# EAGLE design HM-Relais4-flach-v01-036 (EAGLE 9.5.1)
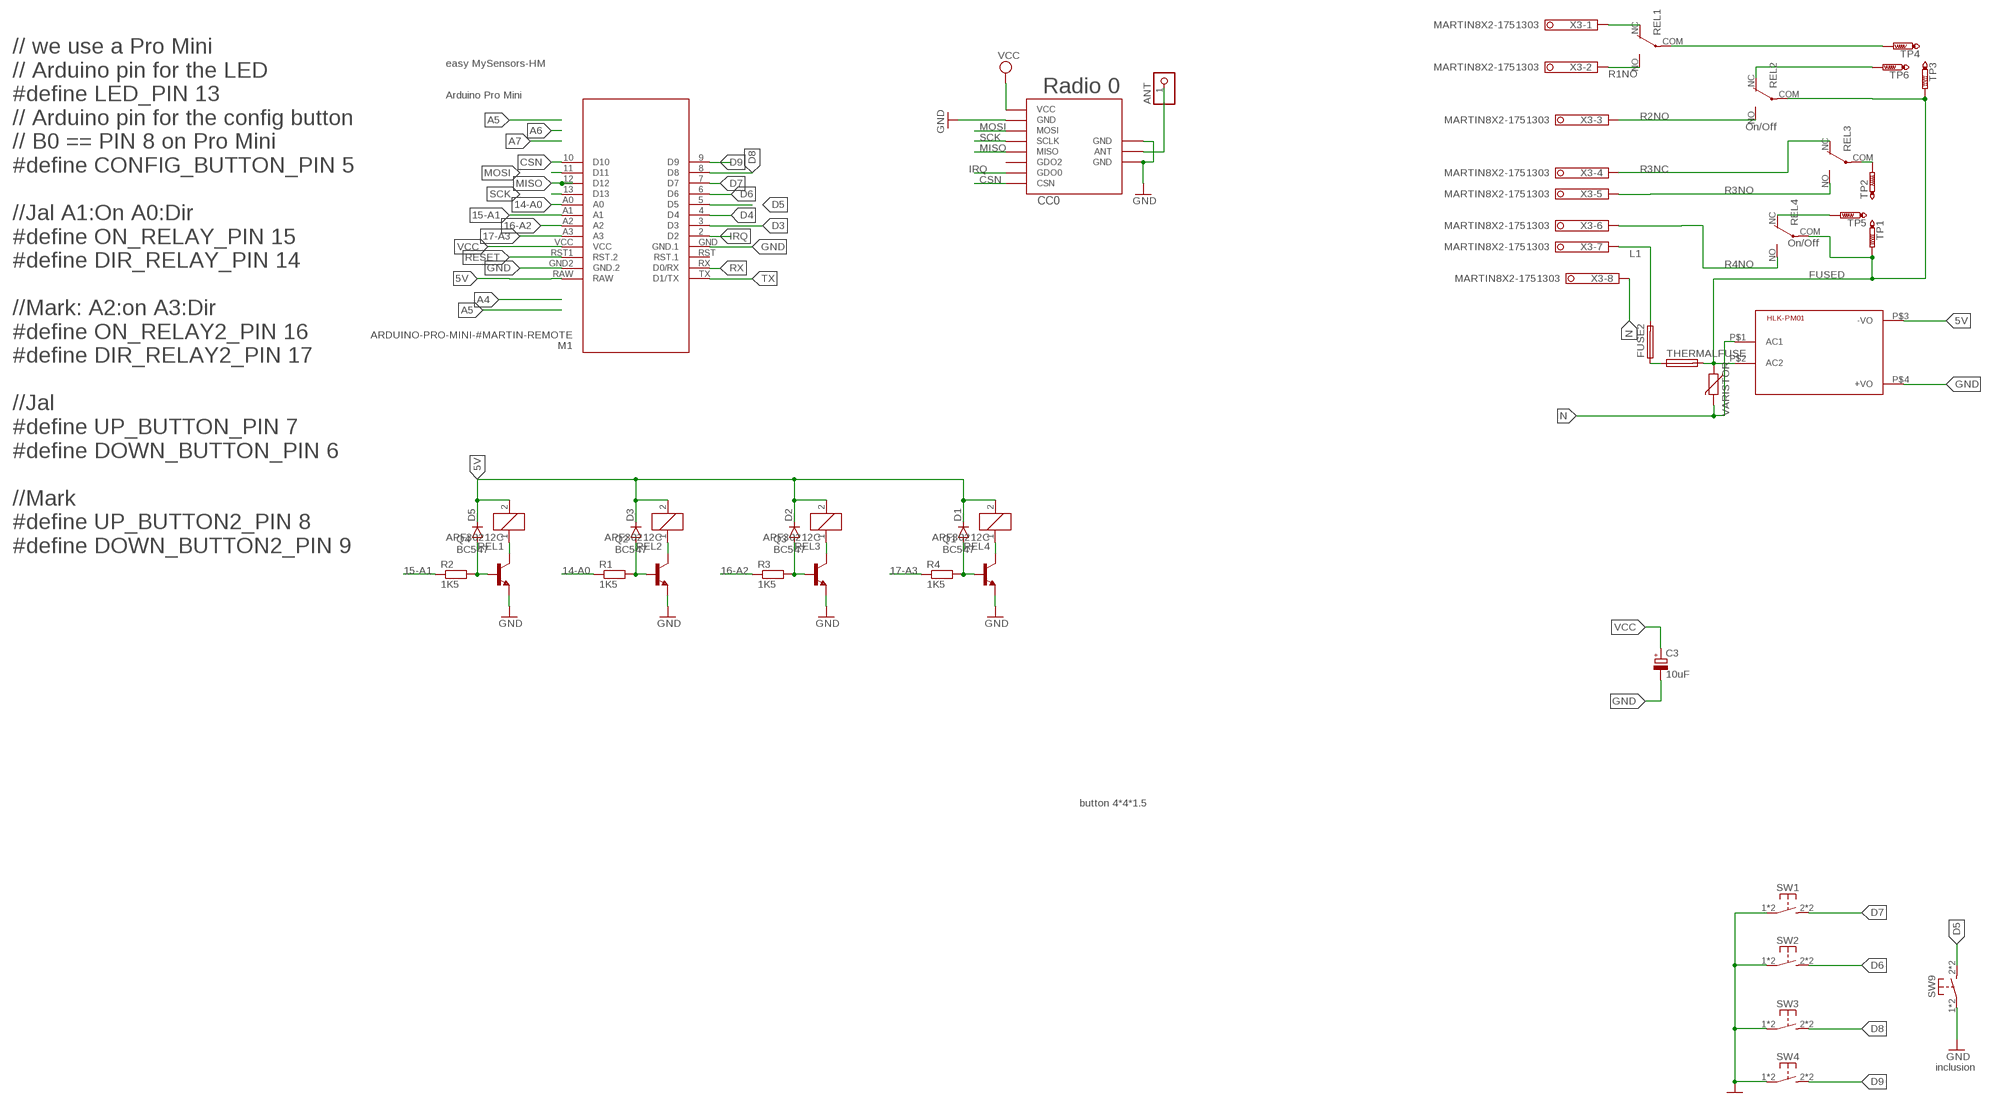
[diagram p0: schematic, sheet 1]

## Parts
ANT  PINHD-1X1  [1X01]
C3  10uF  CPOL-EUSMCC  [SMC_C]
CC0  CC1101  CC1101_MODULE1SMD  [CC1101_MODULE1_SMD]
D1  DIODE-D-2.5  [D-2.5]
D2  DIODE-D-2.5  [D-2.5]
D3  DIODE-D-2.5  [D-2.5]
D5  DIODE-D-2.5  [D-2.5]
FUSE2  FUSETE5  [TE5]
HLK-PM01  HKLPM01  [HKLPM01]
M1  ARDUINO-PRO-MINI-#MARTIN-REMOTE  [ARDUINO-PRO-MINI#NP-MARTIN-REMOTE]
Q1  BC547  [TO92]
Q2  BC547  [TO92]
Q3  BC547  [TO92]
Q4  BC547  [TO92]
R1  1K5  R-EU_0207/2V  [0207/2V]
R2  1K5  R-EU_0207/2V  [0207/2V]
R3  1K5  R-EU_0207/2V  [0207/2V]
R4  1K5  R-EU_0207/2V  [0207/2V]
REL1  APF30212C  [APF30212C]
REL2  APF30212C  [APF30212C]
REL3  APF30212C  [APF30212C]
REL4  APF30212C  [APF30212C]
SW1  SW-TACTILE-TL3305  [TL3305]
SW2  SW-TACTILE-TL3305  [TL3305]
SW3  SW-TACTILE-TL3305  [TL3305]
SW4  SW-TACTILE-TL3305  [TL3305]
SW9  SW-TACTILE-TL3305  [TL3305]
THERMALFUSE  FUSETE5  [TE5]
TP1  PTR1TP11SQ  [TP11SQ]
TP2  PTR1TP11SQ  [TP11SQ]
TP3  PTR1TP11SQ  [TP11SQ]
TP4  PTR1TP11SQ  [TP11SQ]
TP5  PTR1TP11SQ  [TP11SQ]
TP6  PTR1TP11SQ  [TP11SQ]
VARISTOR  VARISTOR-7,5  [R-7,5]
X3  MARTIN8X2-1751303  [1751303]

## Nets
5V [Power]: D1.C D2.C D3.C D5.C HLK-PM01.P$3(-VO) M1.RAW REL1.2 REL2.2 REL3.2 REL4.2
14-A0: M1.A0 R1.1
15-A1: M1.A1 R2.1
16-A2: M1.A2 R3.1
17-A3: M1.A3 R4.1
ANT0: ANT.1 CC0.ANT
CSN: CC0.CSN M1.10(D10)
D3: M1.3(D3)
D4: M1.4(D4)
D5: M1.5(D5) SW9.2(S1) SW9.3(S1)
D6: M1.6(D6) SW2.2(S1) SW2.3(S1)
D7: M1.7(D7) SW1.2(S1) SW1.3(S1)
D8: M1.8(D8) SW3.2(S1) SW3.3(S1)
D9: M1.9(D9) SW4.2(S1) SW4.3(S1)
FUSED [230V-Fuse]: HLK-PM01.P$2(AC2) REL2.COM(2:P) REL4.COM(2:P) THERMALFUSE.2 TP1.TP TP3.TP VARISTOR.1
GND [Power]: C3.- CC0.GND@0(GND) CC0.GND@1(GND) CC0.GND@2(GND) HLK-PM01.P$4(+VO) M1.GND2(GND.2) M1.GND(GND.1) Q1.1(E) Q2.1(E) Q3.1(E) Q4.1(E) SW1.1 SW1.4(P1) SW2.1 SW2.4(P1) SW3.1 SW3.4(P1) SW4.1 SW4.4(P1) SW9.1 SW9.4(P1)
IRQ: CC0.GDO0 M1.2(D2)
L1 [230V-Fuse]: FUSE2.2 X3.15
MISO: CC0.MISO M1.12(D12)
MOSI: CC0.MOSI M1.11(D11)
N [230V]: HLK-PM01.P$1(AC1) VARISTOR.2 X3.16
N$1 [230V-Fuse]: FUSE2.1 THERMALFUSE.1
N$2: Q2.3(C) REL2.1
N$3: D3.A Q2.2(B) R1.2
N$4 [230V-Small]: REL3.COM(2:P) TP2.TP
N$5: Q3.3(C) REL3.1
N$6: D2.A Q3.2(B) R3.2
N$7: REL4.NC(2:O) TP5.TP
N$8: Q1.3(C) REL4.1
N$9: D1.A Q1.2(B) R4.2
N$11 [230V-Fuse]: REL1.COM(2:P) TP4.TP
N$12 [230V-Small]: REL2.NC(2:O) TP6.TP
N$13: Q4.3(C) REL1.1
N$16: D5.A Q4.2(B) R2.2
R1NC [230V]: REL1.NC(2:O) X3.9
R1NO [230V]: REL1.NO(2:S) X3.10
R2NO [230V]: REL2.NO(2:S) X3.11
R3NC [230V]: REL3.NC(2:O) X3.12
R3NO [230V]: REL3.NO(2:S) X3.13
R4NO [230V]: REL4.NO(2:S) X3.14
RESET: M1.RST1(RST.2)
RX: M1.RX(D0/RX)
SCK: CC0.SCLK M1.13(D13)
TX: M1.TX(D1/TX)
VCC [Power]: C3.+ CC0.VCC M1.VCC
Unconnected: CC0.GDO2 M1.RST(RST.1)

## Notes on the sheet
- easy MySensors-HM
- Radio 0
- Arduino Pro Mini
- On/Off
- On/Off
- // we use a Pro Mini
  // Arduino pin for the LED
  #define LED_PIN 13
  // Arduino pin for the config button
  // B0 == PIN 8 on Pro Mini
  #define CONFIG_BUTTON_PIN 5
  
  //Jal A1:On A0:Dir
  #define ON_RELAY_PIN 15
  #define DIR_RELAY_PIN 14
  
  //Mark: A2:on A3:Dir
  #define ON_RELAY2_PIN 16
  #define DIR_RELAY2_PIN 17
  
  //Jal
  #define UP_BUTTON_PIN 7
  #define DOWN_BUTTON_PIN 6
  
  //Mark
  #define UP_BUTTON2_PIN 8
  #define DOWN_BUTTON2_PIN 9
- button 4*4*1.5
- inclusion

## Library data of the parts
ANT = pinhead:PINHD-1X1: PIN HEADER
C3 = rcl@1:CPOL-EU: POLARIZED CAPACITOR, European symbol; SPICEPREFIX: C
CC0 = wireless:CC1101_MODULE1: CC1101 wireless module for 433/868 MHz (sold from Aliexpress). DIL version for mounting with pin header (and SMD soldering) and SMD only variant available.
D1-D3 D5 = diode:DIODE-: DIODE
FUSE2 THERMALFUSE = fuse:FUSE: Fuse; OC_FARNELL: unknown; OC_NEWARK: unknown
HLK-PM01 = HKLPM01:HKLPM01
M1 = diy-modules-Martin:ARDUINO-PRO-MINI-*#MARTIN-REMOTE: Arduino Pro Mini (and compatible devices) without programming pads More details available here: https://www.arduino.cc/en/Main/ArduinoBoardProMini Click here to find device on ebay.com <http://www.ebay.com/sch/arduino+pro+mini>
Q1-Q4 = transistor-npn:BC547*: NPN Transistor
R1-R4 = rcl:R-EU_: RESISTOR, European symbol; SPICEPREFIX: R
REL1-REL4 = relay:APF30212C: Compliant with European standards 1a/1c 6A Slim power relays Source: Data sheet <http://pewa.panasonic.com/assets/pcsd/catalog/pf-catalog.pdf>; OC_FARNELL: unknown
SW1-SW4 SW9 = we-switch:SW-TACTILE: Tactile Switches
TP1-TP6 = testpad:PTR1: TEST PIN
VARISTOR = varistor:VARISTOR: VARISTOR
X3 = con-phoenix-350-Martin:MARTIN8X2-1751303: MKDS 1/ 8-3,5 Printklemme Nennstrom: 10 A Bemessungsspannung: 160 V Raster: 3,5 mm Polzahl: 8 Montageart: Löten Anschlussart: Schraubanschluss Anschlussrichtung vom Leiter zur Platine: 0° Source: http://eshop.phoenixcontact.com .. .pdf; OC_FARNELL: unknown; OC_NEWARK: unknown

## Net classes
0 default: width 0.305 mm
1 Power: width 0.457 mm
2 230V: width 0.762 mm, clearance 5 mm to class 0, clearance 5 mm to class 1, clearance 1 mm
3 230V-Fuse: width 0.762 mm, clearance 5 mm to class 0, clearance 5 mm to class 1, clearance 1 mm to class 2, clearance 1 mm
4 230V-Small: width 0.61 mm, clearance 5 mm to class 0, clearance 5 mm to class 1, clearance 1 mm to class 2, clearance 1 mm to class 3, clearance 1 mm

## Board
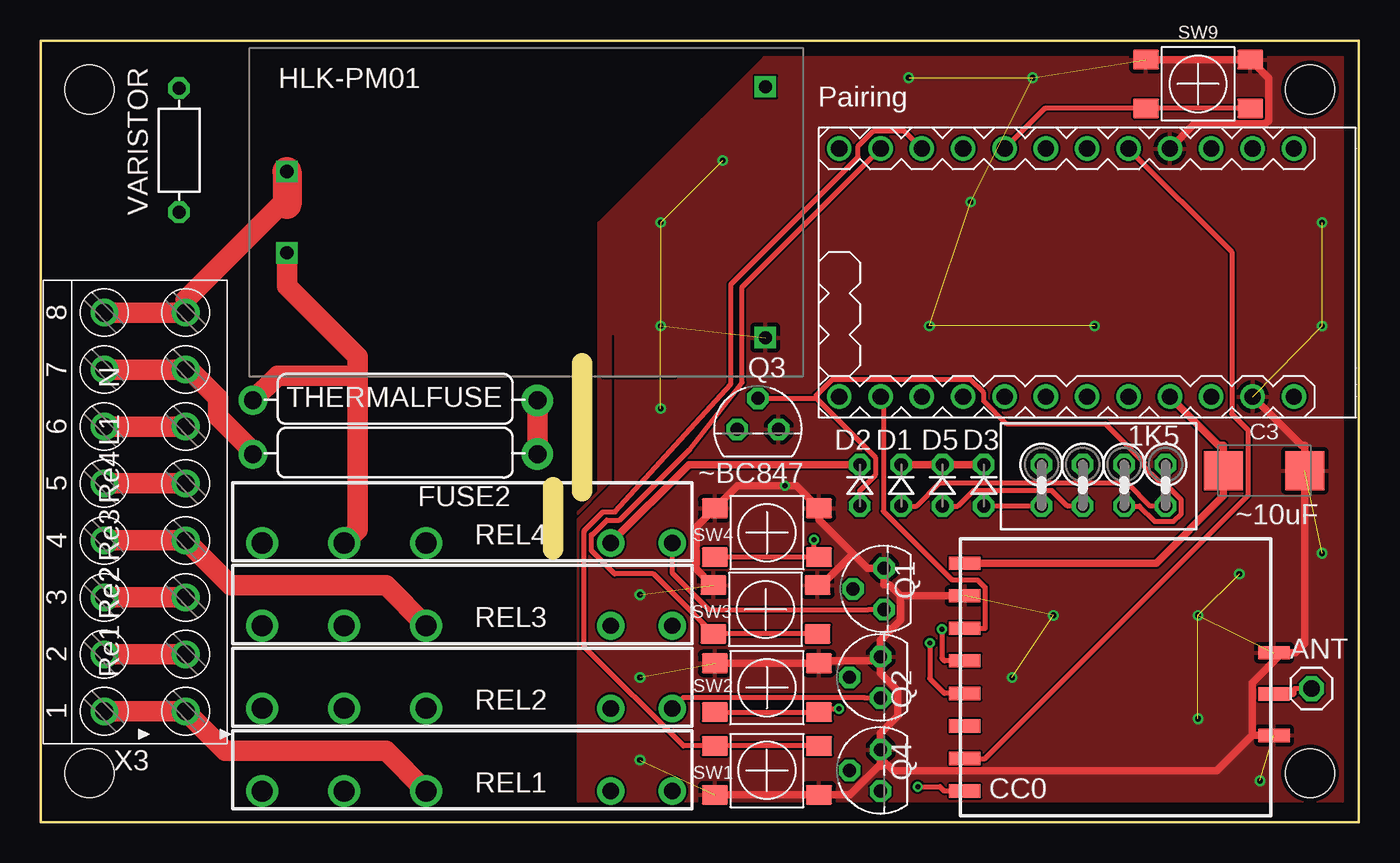
[diagram p1: board, top side]
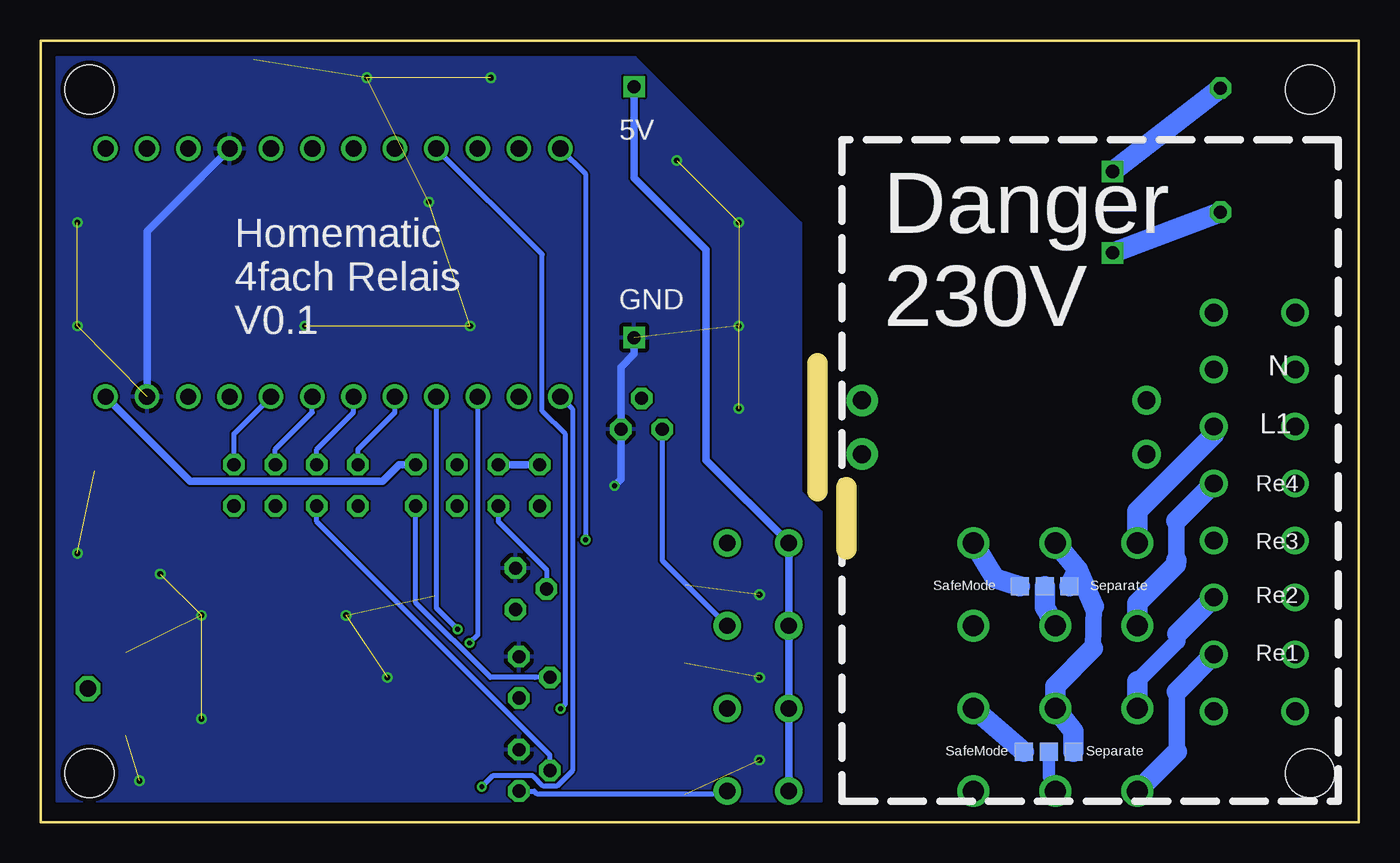
[diagram p2: board, bottom side, seen from below]

Size 81 x 48 mm. Coordinates in mm from the lower left corner, seen from the top.
Outline: 0,0 0,48 81,48 81,0 0,0
Copper layers (1*16): Top 0.035mm / dielectric 1.5mm / Bottom 0.035mm
Design rules "dirt_cheap_dirty_boards.v1": minimum track width 5mil, minimum drill 12mil, track to track 5mil, track to pad 5mil, pad to pad 5mil, via to via 5mil, smd to smd 0mil, copper to edge 10mil, drill to drill 10mil, minimum pad ring 10mil, minimum via ring 6mil, stop-mask expansion 2mil, vias tented up to drill 25mil, thermal gap 10mil
Holes 3 mm at 78,3 78,45 3,45 3,3
tRestrict: 3 lines
Milling: 2 lines

### Footprints (pad centres in the part's own frame; a part is rotated, then mirrored left to right if it is on the bottom)
1X01 = drill 1.016 octagon: 1 0,0
SMC_C = smd 2.4 x 2.4: + -2.5,0; - 2.5,0
CC1101_MODULE1_SMD = smd 1.93 x 0.813: ANT 19,5.96; CSN 0,0; GDO0 0,2; GDO2 0,4; GND@0 0,12; GND@1 19,8.5; GND@2 19,3.42; MISO 0,6; MOSI 0,10; SCLK 0,8; VCC 0,14
D-2.5 = drill 0.813 octagon: A 1.27,0; C -1.27,0
TE5 = drill 1.1 pad 1.93: 1 -5.632,0 | drill 1.1 pad 1.778: 2 11.852,0
HKLPM01 = drill 0.8 square: P$1 -14.7,2.5; P$2 -14.7,-2.5; P$3 14.7,7.7; P$4 14.7,-7.7
ARDUINO-PRO-MINI#NP-MARTIN-REMOTE = drill 1: 2 -2.54,-7.62; 3 0,-7.62; 4 2.54,-7.62; 5 5.08,-7.62; 6 7.62,-7.62; 7 10.16,-7.62; 8 12.7,-7.62; 9 15.24,-7.62; 10 15.24,7.62; 11 12.7,7.62; 12 10.16,7.62; 13 7.62,7.62; A0 5.08,7.62; A1 2.54,7.62; A2 0,7.62; A3 -2.54,7.62; GND -10.16,7.62; GND2 -5.08,-7.62; RAW -12.7,7.62; RST -7.62,7.62; RST1 -7.62,-7.62; RX -10.16,-7.62; TX -12.7,-7.62; VCC -5.08,7.62
TO92 = drill 0.813 octagon: 1 1.27,0; 2 0,1.905; 3 -1.27,0
0207/2V = drill 0.813 octagon: 1 -1.27,0; 2 1.27,0
APF30212C = drill 1 pad 1.7: 1 -12.6,0; 2 -8.82,0 | drill 1.3 pad 1.9: COM 7.56,0; NC 2.52,0; NO 12.6,0
TL3305 = smd 1.6 x 1.2: 1 -3.2,1.5; 2 -3.2,-1.5; 3 3.2,-1.5; 4 3.2,1.5
TP11SQ = smd 1.1 x 1.1: TP 0,0
R-7,5 = drill 0.813 octagon: 1 -3.81,0; 2 3.81,0
1751303 = drill 1.1 pad 1.7: 1 -12.25,-0.1; 2 -8.75,-0.1; 3 -5.25,-0.1; 4 -1.75,-0.1; 5 1.75,-0.1; 6 5.25,-0.1; 7 8.75,-0.1; 8 12.25,-0.1; 9 -12.25,-5.1; 10 -8.75,-5.1; 11 -5.25,-5.1; 12 -1.75,-5.1; 13 1.75,-5.1; 14 5.25,-5.1; 15 8.75,-5.1; 16 12.25,-5.1

### Placement (x,y rotation side)
ANT  78.1,8.2 0 top
C3  75.19,21.59 0 top
CC0  56.78,1.91 0 top
D1  52.88,20.68 270 top
D2  50.34,20.68 270 top
D3  57.96,20.68 270 top
D5  55.42,20.68 270 top
FUSE2  24.89,22.61 180 top
HLK-PM01  29.83,37.47 0 top
M1  64.31,33.75 180 top
Q1  51.82,14.32 90 top
Q2  51.61,8.89 90 top
Q3  44.07,24.13 0 top
Q4  51.61,3.17 90 top
R1  61.5,20.68 270 top
R2  64.04,20.68 270 top
R3  66.58,20.68 270 top
R4  69.12,20.68 270 top
REL1  26.21,1.91 180 top
REL2  26.21,6.99 180 top
REL3  26.21,12.06 180 top
REL4  26.21,17.14 180 top
SW1  44.62,3.17 180 top
SW2  44.62,8.26 0 top
SW3  44.54,13.06 0 top
SW4  44.62,17.78 0 top
SW9  71.12,45.34 0 top
THERMALFUSE  24.89,25.91 180 top
TP1  17.78,14.48 0 bottom
TP2  19.3,14.48 0 bottom
TP3  17.53,4.32 0 bottom
TP4  19.05,4.32 0 bottom
TP5  20.83,14.48 0 bottom
TP6  20.57,4.32 0 bottom
VARISTOR  8.51,41.27 90 top
X3  3.81,19.05 90 top

### Tracks (layer width: path | path; a pad name or v marks a point on that pad's centre or on a via)
5V
  Top 0.457: D2.C 49.32,21.95 39.84,21.95 REL4.2 | D1.C D5.C D3.C
  Bottom 0.457: HLK-PM01.P$3 44.53,39.58 40.11,35.16 40.11,22.23 REL4.2 REL3.2 REL2.2 REL1.2 | D2.C D1.C | D3.C 58.98,21.95 60,20.93 71.81,20.93 M1.RAW
14-A0
  Bottom 0.305: R1.1 61.5,22.89 59.23,25.16 M1.A0
15-A1
  Bottom 0.305: R2.1 64.04,22.89 61.77,25.16 M1.A1
16-A2
  Bottom 0.305: R3.1 66.58,22.89 64.31,25.16 M1.A2
17-A3
  Bottom 0.305: R4.1 69.12,23.86 M1.A3
ANT0
  Top 0.305: CC0.ANT 77.03,7.87 77.03,8.17 77.06,8.2 ANT.1
CSN  (via drill 0.3 pad 0.61)
  Top 0.305: CC0.CSN 55.54,1.91 55.26,2.18 v53.89,2.18
  Bottom 0.305: M1.10 48.32,25.38 48.32,3.16 49.27,2.21 50.11,2.21 50.75,2.85 53.23,2.85 v53.89,2.18
D5
  Top 0.305: M1.5 61.7,43.84 SW9.2 SW9.3
D6  (via drill 0.3 pad 0.61)
  Top 0.305: v49.06,6.96 48.03,6.96 SW2.3 SW2.2
  Bottom 0.305: v49.06,6.96 48.75,7.27 48.75,23.82 50.19,25.25 50.19,34.87 M1.6
D7
  Top 0.305: M1.7 53.06,42.46 51.17,42.46 50.23,41.51 50.23,40.85 42.41,33.04 42.41,26.91 35.31,19.05 34.54,19.05 33.39,17.9 33.39,17.82 33.39,10.78 39.5,4.67 SW1.3 SW1.2
D8
  Top 0.305: M1.8 43.11,32.87 43.11,27 39.88,22.86 35.81,18.8 35.56,18.54 34.8,18.54 33.92,17.66 33.85,17.66 33.85,16.68 35.27,15.25 37.65,15.25 SW3.2 SW3.3
D9  (via drill 0.3 pad 0.61)
  Top 0.305: 47.52,16.28 v47.52,17.36 | 47.52,16.28 SW4.2 | SW4.3 47.52,16.28
  Bottom 0.305: M1.9 47.52,39.82 v47.52,17.36
FUSED
  Top 0.762: 19.46,17.96 REL4.COM
  Top 1.27: HLK-PM01.P$2 15.13,32.93 19.46,28.6 19.46,27.43 | 19.46,27.43 19.46,17.96 REL4.COM | THERMALFUSE.2 14.56,27.43 19.46,27.43
  Bottom 1.016: 16.28,13.25 16.33,10.67
  Bottom 1.27: 17.27,15.49 16.28,13.25 | 16.33,10.67 18.65,8.35 REL2.COM 17.53,5.59 TP3.TP | TP1.TP 17.27,15.49 | REL4.COM 17.27,15.49 | VARISTOR.1 HLK-PM01.P$2
GND  (via drill 0.3 pad 0.61, 0.35)  (21 unrouted)
  Top 0.457: 52.84,13.9 52.16,14.58 51.82,14.58 Q1.1 51.31,15.6 50.8,15.6 49.91,16.48 | 52.84,13.9 52.84,12.4 51.61,11.18 Q2.1 51.61,10.03 51.61,9.91 | 52.84,13.9 55.46,13.9 CC0.GND@0 | 51.61,3.94 52.41,3.14 72.28,3.14 74.46,5.33 | 51.61,3.94 51.61,3.43 51.48,3.43 49.72,1.68 SW1.1 SW1.4 | 51.61,3.94 Q4.1 51.61,4.95 51.61,5.46 52.69,6.54 52.69,8.06 51.61,9.14 51.61,9.89 51.61,9.91 | CC0.GND@2 74.46,5.33 | 76.31,10.4 74.46,8.56 74.46,5.33 | 76.31,10.4 77.11,10.4 77.69,10.98 C3.- 77.69,23.15 77.45,23.15 M1.GND | CC0.GND@1 76.31,10.4 | SW3.1 41.26,14.56 40.27,15.55 40.27,18.12 SW4.1 42.81,20.66 v45.73,20.66 46.44,20.66 SW4.4 47.83,18.57 49.91,16.48 | 51.61,9.91 47.98,9.91 SW2.4 SW2.1 | SW3.4 47.99,14.56 49.91,16.48 | M1.GND2 70.9,42.88 75.26,42.88 75.48,43.1 75.48,45.68 SW9.4 SW9.1
  Bottom 0.457: v45.73,20.66 45.34,21.05 Q3.1 45.34,27.95 44.53,28.75 HLK-PM01.P$4 | M1.GND2 74.47,36.29 M1.GND
  other vias: 38.1,36.83 38.1,25.4 53.34,45.72 78.74,36.83 78.74,30.48 74.93,2.54 78.74,16.51 73.66,15.24 71.12,6.35 62.23,12.7 59.69,8.89 71.12,12.7 36.83,3.81 36.83,8.89 36.83,13.97 38.1,30.48 54.61,30.48 41.91,40.64 60.96,45.72 64.77,30.48 57.15,38.1
  pour Top: 80.01,46.99 44.45,46.99 40.64,43.18 34.29,36.83 34.29,20.32 33.02,19.05 33.02,1.27 80.01,1.27
  pour Bottom: 80.01,46.99 44.45,46.99 34.29,36.83 34.29,20.32 33.02,19.05 33.02,1.27 80.01,1.27
IRQ
  Top 0.305: CC0.GDO0 58.03,3.9 74.17,20.04 74.17,24.11 73.19,25.08 73.19,35.03 M1.2
L1
  Top 1.27: X3.15 9.16,27.8 10.92,26.04 10.92,24.89 13.04,22.77 FUSE2.2
  Bottom 1.27: X3.15 9.16,27.8
MISO  (via drill 0.3 pad 0.61)
  Top 0.305: CC0.MISO 55.54,7.91 54.63,8.81 v54.63,11
  Bottom 0.305: M1.12 54.15,11.49 v54.63,11
MOSI
  Top 0.305: CC0.MOSI 58.03,11.9 58.03,14.43 57.58,14.88 56,14.88 51.78,19.11 51.78,25.96 M1.11
N
  Top 0.762: X3.16 8.91,32.09 | 14.75,37.93 15.13,37.93
  Top 1.27: 8.91,32.09 14.75,37.93
  Top 1.778: HLK-PM01.P$1 15.13,37.93
  Bottom 1.27: VARISTOR.2 HLK-PM01.P$1
N$1
  Top 1.27: FUSE2.1 THERMALFUSE.1
N$2
  Top 0.305: Q2.3 50.67,7.62 50.62,7.67 39.49,7.67 REL2.1
N$3
  Top 0.305: R1.2 D3.A
  Bottom 0.305: Q2.2 50.65,8.89 53.37,8.89 57.96,13.48 D3.A
N$4
  Bottom 1.27: TP2.TP 19.3,13.21 REL3.COM
N$5
  Bottom 0.305: REL3.1 42.8,16.05 Q3.3
N$6
  Top 0.305: R3.2 67.52,19.41 68.46,18.47 69.61,18.47 70.08,18.94 70.08,19.8 68.99,20.89 68.74,20.89 67.83,21.81 67.83,22.08 65.45,24.45 59.39,24.45 57.96,25.88 57.96,26.36 57.15,27.18 48.62,27.18 47.67,26.22 47.67,26.04 | 47.67,26.04 51.29,22.41 51.29,21.31 50.34,20.36 D2.A | Q3.2 47.67,26.04
N$7
  Bottom 1.27: TP5.TP 22.35,14.99 REL4.NC
N$8
  Top 0.305: Q1.3 50.88,13.05 41.06,13.05 38.81,15.3 REL4.1
N$9
  Top 0.305: D1.A 53.82,19.41 55.2,20.8 66.8,20.8 68.18,19.41 R4.2
  Bottom 0.305: D1.A 52.88,18.48 49.91,15.51 Q1.2
N$11
  Bottom 0.762: TP4.TP 19.05,2.79 18.65,2.39 REL1.COM
N$12
  Bottom 1.27: TP6.TP REL2.NC
N$13
  Bottom 0.305: Q4.3 50.67,1.91 50.49,1.73 38.99,1.73 REL1.1
N$16
  Top 0.305: D5.A 56.36,19.41 57.31,20.37 62.15,20.37 63.1,19.41 R2.2
  Bottom 0.305: R2.2 64.04,18.45 49.7,4.12 Q4.2
R1NC
  Top 1.27: X3.9 11.33,4.38 21.21,4.38 REL1.NC
R1NO
  Bottom 1.016: 11.2,8.01 11.2,4.32
  Bottom 1.27: X3.10 11.2,8.01 | 11.2,4.32 REL1.NO
R2NO
  Bottom 0.762: 11.14,11.57 11.14,11.11
  Bottom 1.016: 11.14,11.11 13.61,8.64
  Bottom 1.27: X3.11 11.14,11.57 | 13.61,8.64 REL2.NO
R3NC
  Top 1.27: X3.12 11.67,14.54 21.21,14.54 REL3.NC
R3NO
  Bottom 1.016: 11.22,18.51 11.22,16.09
  Bottom 1.27: X3.13 8.92,20.8 11.22,18.51 | 11.22,16.09 11.25,15.82 13.61,13.45 REL3.NO
R4NO
  Bottom 1.27: X3.14 8.91,23.79 13.61,19.09 REL4.NO
SCK  (via drill 0.3 pad 0.61)
  Top 0.305: CC0.SCLK 55.54,9.9 55.38,10.06 v55.38,11.85
  Bottom 0.305: M1.13 56.69,13.16 v55.38,11.85
VCC
  Top 0.457: CC0.VCC 68.56,15.9 72.69,20.03 C3.+ 72.69,23.15 72.37,23.15 M1.VCC

### Text on the board
tNames: Pairing | N | L1 | 1K5 | ~BC847 | Re4 | ~10uF | Re3 | Re2 | Re2 | Re1
bNames: 5V | GND | Danger / 230V | Homematic / 4fach Relais / V0.1 | N | L1 | Re4 | Re3 | Separate | SafeMode | Re2 | Re1 | Separate | SafeMode